# EAGLE design LCMeter_test_power_inverter (EAGLE 6.1)
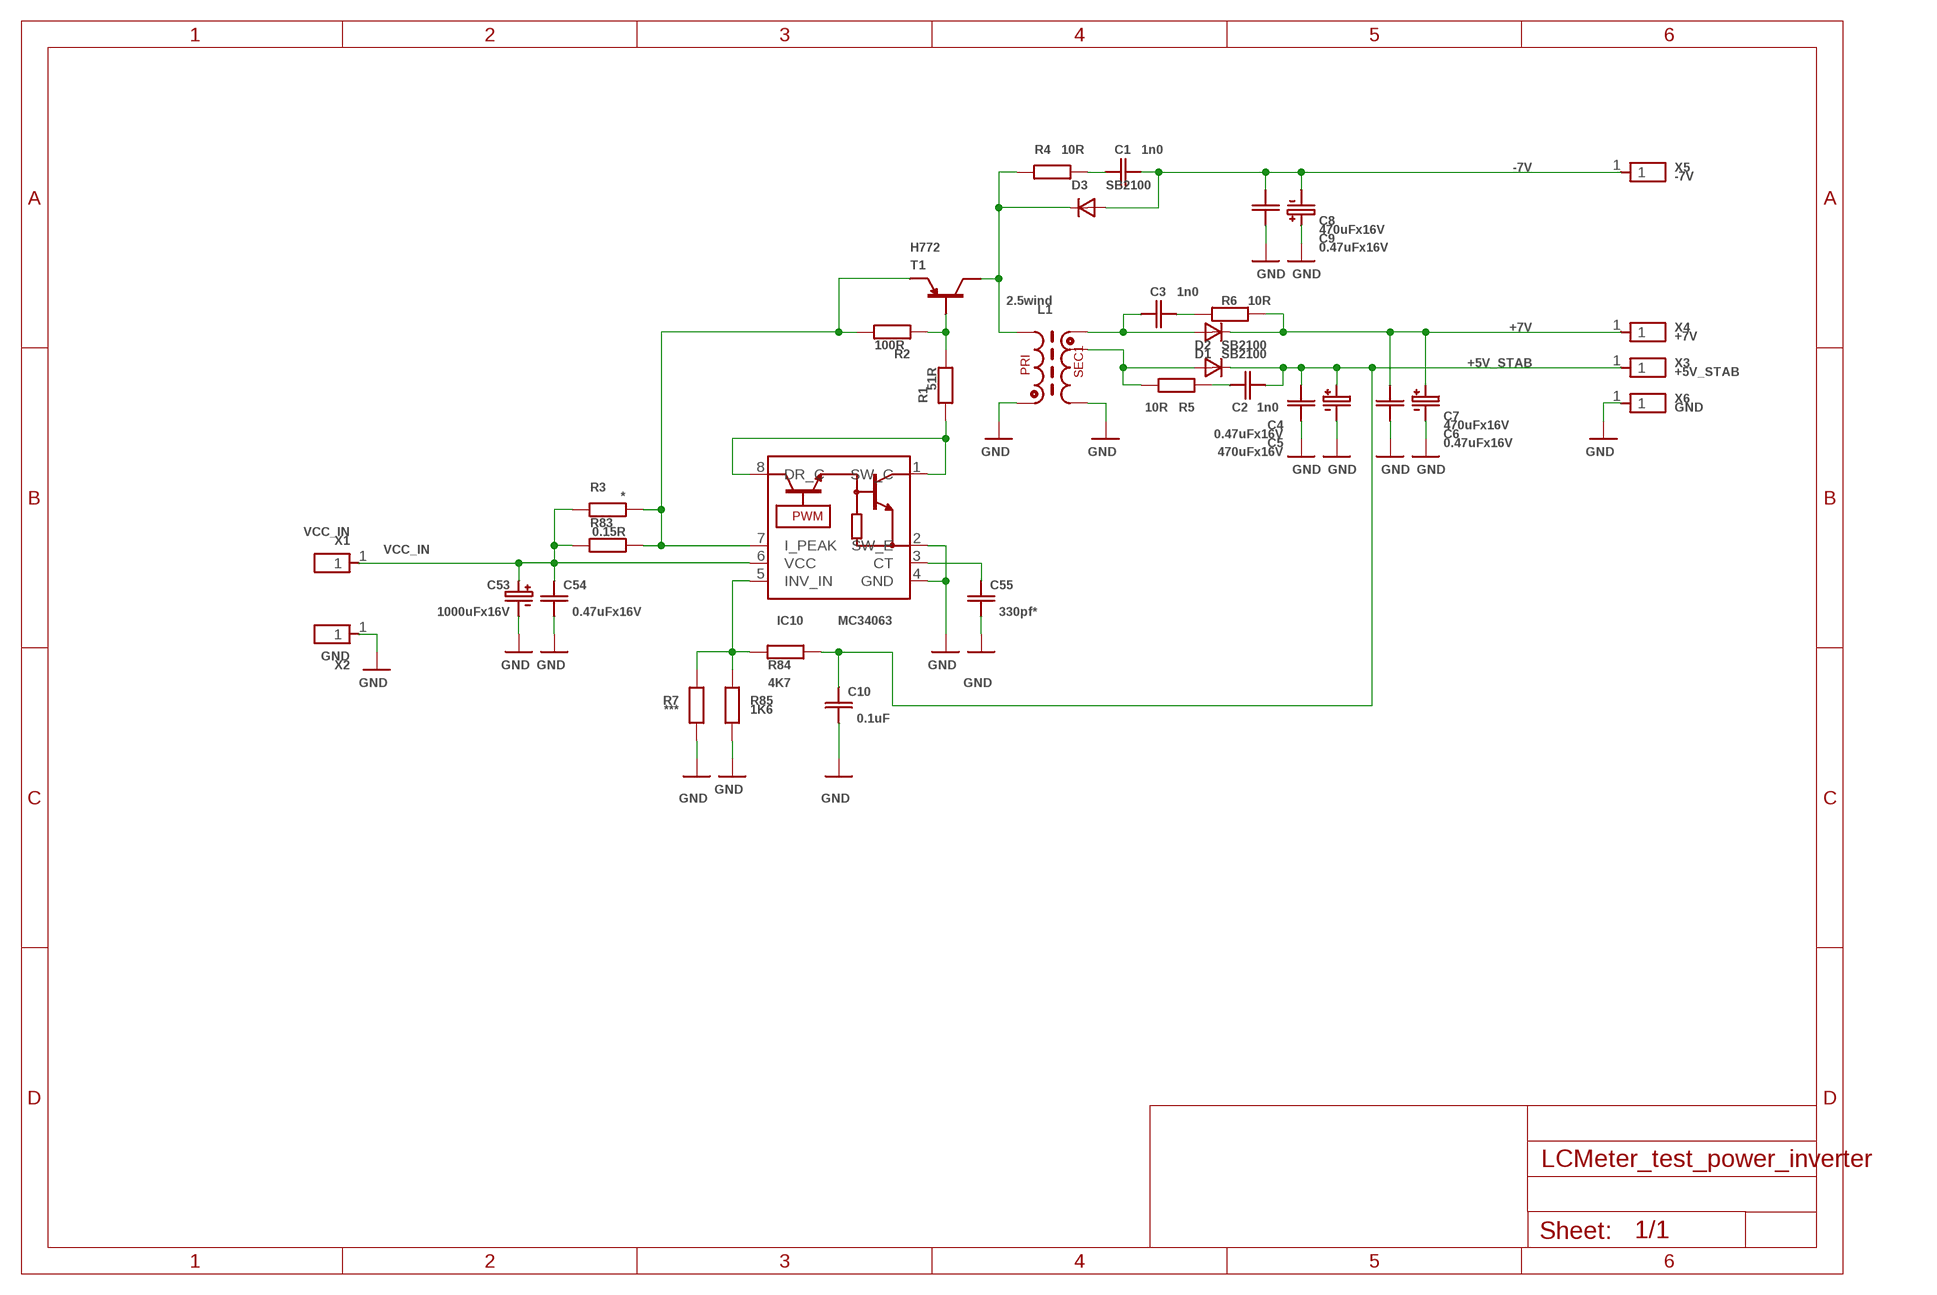
[diagram p0: schematic, sheet 1]

## Parts
C1  1n0  CSMD_0805  [RSMD_0805]
C2  1n0  CSMD_0805  [RSMD_0805]
C3  1n0  CSMD_0805  [RSMD_0805]
C4  0.47uFx16V  CSMD_1206_BIG_GAP  [RSMD_1206_BIG_GAP]
C5  470uFx16V  CE10MM  [CE_10MM]
C6  0.47uFx16V  CSMD_1206_BIG_GAP  [RSMD_1206_BIG_GAP]
C7  470uFx16V  CE10MM  [CE_10MM]
C8  470uFx16V  CE10MM  [CE_10MM]
C9  0.47uFx16V  CSMD_1206_BIG_GAP  [RSMD_1206_BIG_GAP]
C10  0.1uF  CSMD_0805  [RSMD_0805]
C53  1000uFx16V  CE10MM  [CE_10MM]
C54  0.47uFx16V  CSMD_1206  [RSMD_1206]
C55  330pf*  CSMD_0805  [RSMD_0805]
D1  SB2100  1N4001DO-41_12.5MM  [DO-41_12.5MM]
D2  SB2100  1N4001DO-41_5MM  [DO-41_5MM]
D3  SB2100  1N4001DO-41_12.5MM  [DO-41_12.5MM]
IC10  MC34063  MC34063(SO-8)  [SOIC8]
L1  2.5wind  TRANS_2.5_WIND16X8  [RING_16X8_2.5WIND]
R1  51R  RSMD_1206_BIG_GAP  [RSMD_1206_BIG_GAP]
R2  100R  RSMD_0805  [RSMD_0805]
R3  *  RSMD_1206_BIG_GAP  [RSMD_1206_BIG_GAP]
R4  10R  RSMD_1206_BIG_GAP  [RSMD_1206_BIG_GAP]
R5  10R  RSMD_1206_BIG_GAP  [RSMD_1206_BIG_GAP]
R6  10R  RSMD_1206_BIG_GAP  [RSMD_1206_BIG_GAP]
R7  ***  RSMD_0805  [RSMD_0805]
R83  0.15R  RSMD_1206_BIG_GAP  [RSMD_1206_BIG_GAP]
R84  4K7  R0207  [R0207]
R85  1K6  RSMD_0805  [RSMD_0805]
T1  H772  H772_PNPDPAK  [DPAK]
X1  VCC_IN  PIN1X13.5MM_PWR  [PIN1X1_3.5MM_PWR]
X2  GND  PIN1X13.5MM_PWR  [PIN1X1_3.5MM_PWR]
X3  +5V_STAB  PIN1X13.5MM_PWR  [PIN1X1_3.5MM_PWR]
X4  +7V  PIN1X13.5MM_PWR  [PIN1X1_3.5MM_PWR]
X5  -7V  PIN1X13.5MM_PWR  [PIN1X1_3.5MM_PWR]
X6  GND  PIN1X13.5MM_PWR  [PIN1X1_3.5MM_PWR]

## Nets
+5V_STAB: C2.PAD_0(PIN0) C4.PAD_1(PIN1) C5.PLUS C10.PAD_1(PIN1) D1.CATHODE R84.PAD1(PIN1) X3.1
+7V: C6.PAD_1(PIN1) C7.PLUS D2.CATHODE R6.PAD_0(PIN0) X4.1
-7V: C1.PAD_0(PIN0) C8.MINUS C9.PAD_1(PIN1) D3.ANODE X5.1
GND: C4.PAD_0(PIN0) C5.MINUS C6.PAD_0(PIN0) C7.MINUS C8.PLUS C9.PAD_0(PIN0) C10.PAD_0(PIN0) C53.MINUS C54.PAD_0(PIN0) C55.PAD_0(PIN0) IC10.2(SW_E) IC10.4(GND) L1.W1_START(PRI_START) L1.W2_END(SEC1_END) R7.PAD_0(PIN0) R85.PAD_0(PIN0) X2.1 X6.1
N$1: C3.PAD_0(PIN0) R6.PAD_1(PIN1)
N$2: R1.PAD_1(PIN1) R2.PAD_0(PIN0) T1.1(B)
N$3: IC10.7(I_PEAK) R2.PAD_1(PIN1) R3.PAD_1(PIN1) R83.PAD_1(PIN1) T1.3(E)
N$4: D3.CATHODE L1.W1_END(PRI_END) R4.PAD_1(PIN1) T1.2(C)
N$5: C1.PAD_1(PIN1) R4.PAD_0(PIN0)
N$7: D1.ANODE L1.W2_NEAR_START(SEC1_NEAR_START) R5.PAD_0(PIN0)
N$8: C3.PAD_1(PIN1) D2.ANODE L1.W2_START(SEC1_START)
N$10: C2.PAD_1(PIN1) R5.PAD_1(PIN1)
N$133: IC10.1(SW_C) IC10.8(DR_C) R1.PAD_0(PIN0)
N$135: C55.PAD_1(PIN1) IC10.3(CT)
N$139: IC10.5(INV_IN) R7.PAD_1(PIN1) R84.PAD_0(PIN0) R85.PAD_1(PIN1)
VCC_IN: C53.PLUS C54.PAD_1(PIN1) IC10.6(VCC) R3.PAD_0(PIN0) R83.PAD_0(PIN0) X1.1

## Library data of the parts
C1-C4 C6 C9 C10 C54 C55 = __MyCommonLib1:C
C5 C7 C8 C53 = __MyCommonLib1:CE
D1-D3 = __MyCommonLib1:1N4001
IC10 = __MyCommonLib1:MC34063
L1 = __MyCommonLib1:TRANS_2.5_WIND
R1-R7 R83-R85 = __MyCommonLib1:R
T1 = __MyCommonLib1:H772_PNP
X1-X6 = __MyCommonLib1:PIN1X1

## Board
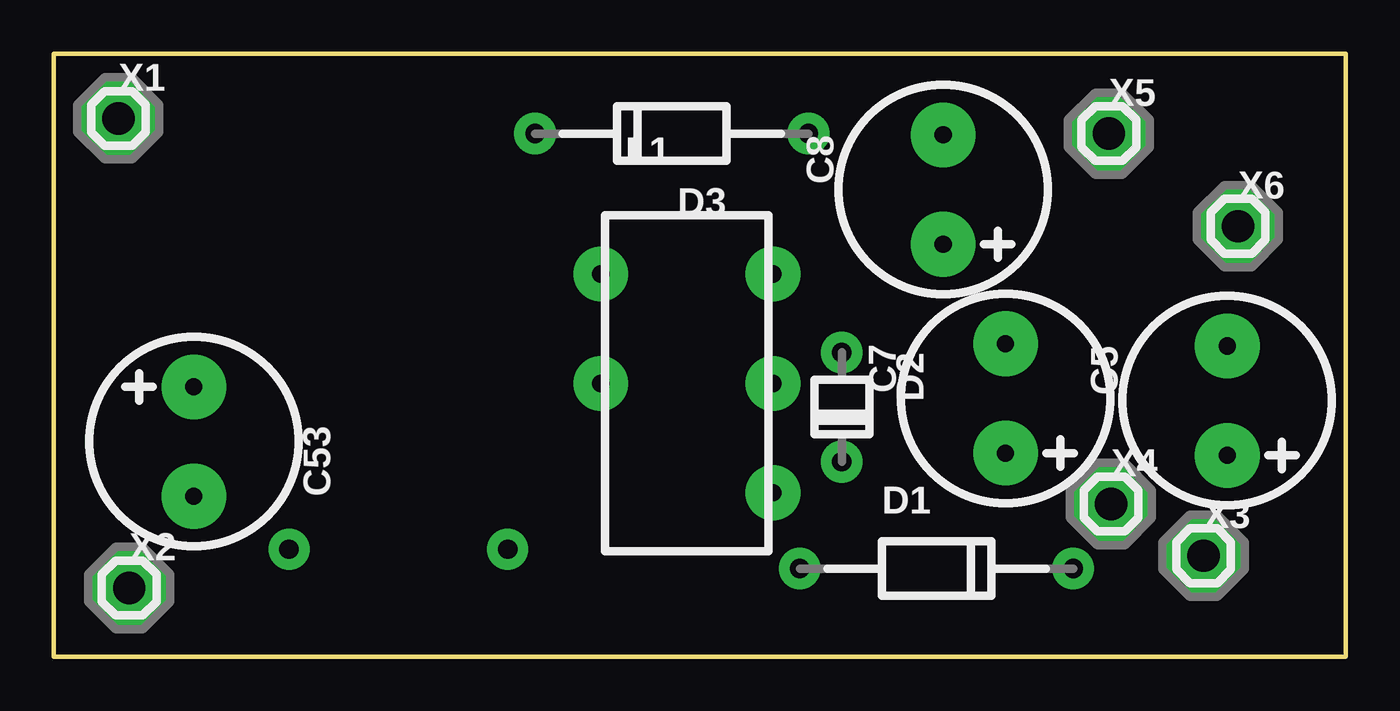
[diagram p1: board, top side]
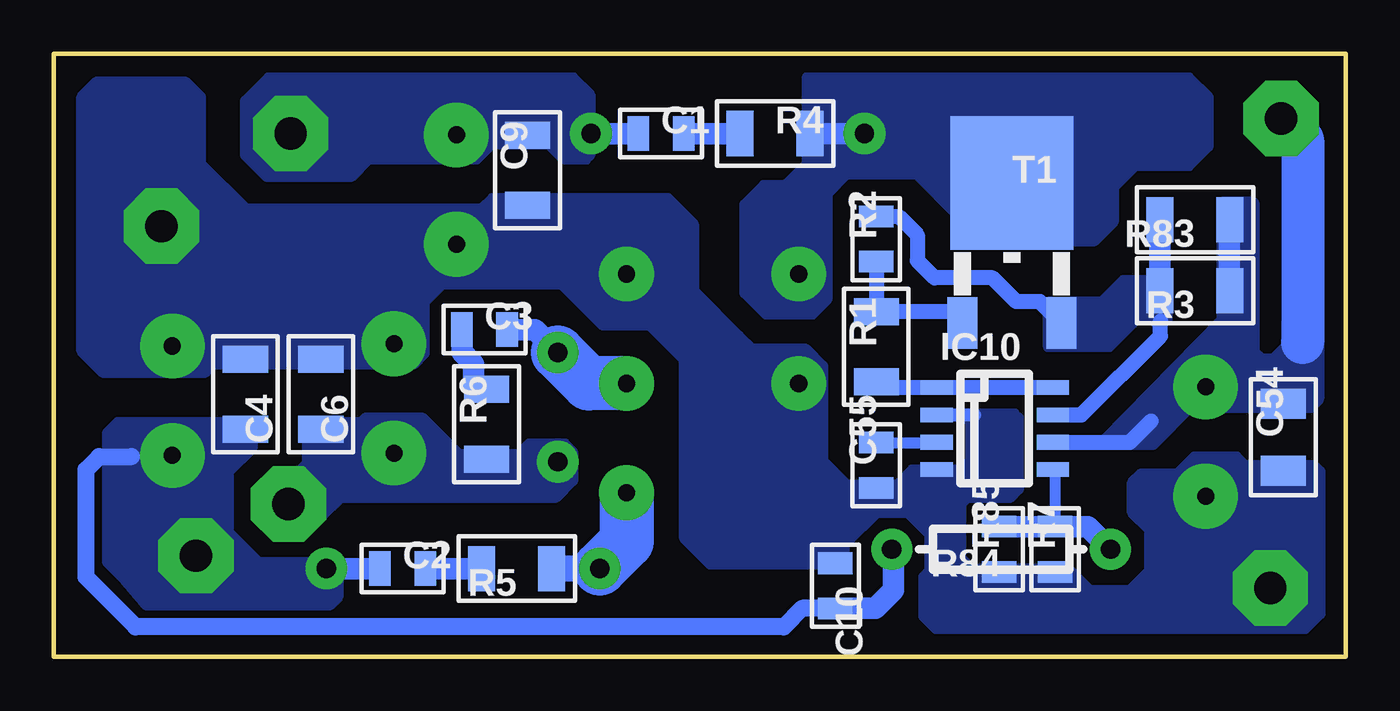
[diagram p2: board, bottom side, seen from below]

Size 60 x 28 mm. Coordinates in mm from the lower left corner, seen from the top.
Outline: 0,0 0,28 60,28 60,0 0,0
Copper layers (1*16): Top 0.035mm / dielectric 1.5mm / Bottom 0.035mm
Design rules: minimum track width 0.35mm, minimum drill 0.6mm, track to track 0.35mm, track to pad 0.35mm, pad to pad 0.35mm, via to via 0.35mm, smd to smd 0.1mm, copper to edge 0.2mm, drill to drill 8mil, minimum pad ring 10mil, minimum via ring 8mil, stop-mask expansion 4mil, vias tented up to drill 0mil, thermal gap 10mil

### Footprints (pad centres in the part's own frame; a part is rotated, then mirrored left to right if it is on the bottom)
RSMD_0805 = smd 1 x 1.6: PAD_0 -1.05,0; PAD_1 1.05,0
RSMD_1206_BIG_GAP = smd 1.25 x 2.1: PAD_0 -1.625,0; PAD_1 1.625,0
CE_10MM = drill 0.8 pad 3: MINUS -2.54,0; PLUS 2.54,0
RSMD_1206 = smd 1.4 x 2.1: PAD_0 -1.55,0; PAD_1 1.55,0
DO-41_12.5MM = drill 0.9 pad 1.93: ANODE -6.35,0; CATHODE 6.35,0
DO-41_5MM = drill 0.9 pad 1.93: ANODE -2.54,0; CATHODE 2.54,0
SOIC8 = smd 1.5 x 0.68: 1 -2.699,1.905; 2 -2.699,0.635; 3 -2.699,-0.635; 4 -2.699,-1.905; 5 2.699,-1.905; 6 2.699,-0.635; 7 2.699,0.635; 8 2.699,1.905
RING_16X8_2.5WIND = drill 0.8 pad 2.54: W1_END -4,5.08; W1_START 4,5.08; W2_END -4,0; W2_NEAR_START 4,-5.08; W2_START 4,0
R0207 = drill 0.9 pad 1.9: PAD1 5.08,0; PAD_0 -5.08,0
DPAK = smd 1.4 x 2.4: 1 -2.3,-6.5; 3 2.3,-6.5 | smd 5.7 x 6.2: 2 0,0
PIN1X1_3.5MM_PWR = drill 1.5 pad 3.5 octagon: 1 0,0

### Placement (x,y rotation side)
C1  31.8,24.3 0 bottom
C2  43.8,4.1 0 bottom
C3  40,15.2 0 bottom
C4  51.1,12.2 270 bottom
C5  54.5,11.9 270 top
C6  47.6,12.2 270 bottom
C7  44.2,12 270 top
C8  41.3,21.7 270 top
C9  38,22.6 90 bottom
C10  23.7,3.3 270 bottom
C53  6.5,10 90 top
C54  2.9,10.2 90 bottom
C55  21.8,8.9 90 bottom
D1  41,4.1 0 top
D2  36.6,11.6 270 top
D3  28.7,24.3 180 top
IC10  16.3,10.6 0 bottom
L1  29.4,12.7 0 top
R1  21.8,14.4 90 bottom
R2  21.8,19.4 90 bottom
R3  7,17 180 bottom
R4  26.5,24.3 0 bottom
R5  38.5,4.1 180 bottom
R6  39.9,10.8 90 bottom
R7  13.5,5 90 bottom
R83  7,20.3 180 bottom
R84  16,5 180 bottom
R85  16.1,5 90 bottom
T1  15.5,22 0 bottom
X1  3,25 0 top
X2  3.5,3.2 0 top
X3  53.4,4.7 0 top
X4  49.1,7.1 0 top
X5  49,24.3 0 top
X6  55,20 0 top

### Tracks (layer width: path | path; a pad name or v marks a point on that pad's centre or on a via)
+5V_STAB
  Bottom 0.8: C10.PAD_1 25.25,2.25 26.1,1.4 56.2,1.4 58.5,3.7 58.5,8.7 57.9,9.3 56.4,9.3
  Bottom 1: C2.PAD_0 D1.CATHODE | C10.PAD_1 21.85,2.25 21,3.1 21,4.92 R84.PAD1
  pour Bottom (no thermals): 46.8,2.8 47.2,2.4 55.7,2.4 56.9,3.8 57.5,4.4 57.5,10.4 57,10.9 50.8,10.9 50.8,9.7 51.9,8.6 51.9,5.8 50.5,4.4 46.8,4.4
+7V
  pour Bottom (no thermals): 35.9,9.4 35.9,8.2 36.7,7.4 46.7,7.4 47.6,6.5 49.9,6.5 49.9,7.8 49.1,8.6 48.6,8.6 48.2,9 48.2,10.8 48.1,10.9 45.7,10.9 45.5,11.1 42.9,11.1 41.9,10.1 41.2,9.4 39.7,9.4 38.4,9.4 37.9,9.9 36.3,9.9 35.9,9.5
-7V
  Bottom 1: C1.PAD_0 D3.ANODE
  pour Bottom (no thermals): 35.9,26.9 35.1,26.1 35.1,23.3 35.3,23.1 36.3,23.1 37,23.8 39.7,23.8 40.4,23.1 45.4,23.1 46.2,22.3 50.1,22.3 51.1,23.3 51.1,25.8 50,26.9
GND
  Bottom 0.6: IC10.2 17.23,11.23
  pour Bottom (no thermals): 51.1,13.6 52.6,13.6 53,13.2 57.7,13.2 58.7,14.2 58.7,26 58,26.7 53.9,26.7 53.2,26 53.2,22.9 51.1,20.8 40.1,20.8 39.6,21.3 31.5,21.3 31,20.8 30.3,20.1 30.3,19.1 30.3,17 28.2,14.9 27.6,14.3 25.1,14.3 24.3,13.5 24.3,11.6 24.3,9.1 23.3,8.1 23.3,4.4 23.4,4.3 29.5,4.3 30.7,5.5 30.7,13.8 32.1,15.2 32.3,15.4 34.5,15.4 36.4,17.3 40.6,17.3 42,17.3 42.8,16.5 42.8,14.1 43.3,13.6
  pour Bottom (no thermals): 4.7,8.9 1.5,8.9 1.2,8.6 1.2,2 1.9,1.3 19,1.3 19.6,1.9 19.6,3.7 19.3,4 19.3,5.7 20.3,6.7 21.8,6.7 23.2,5.3 23.9,5.3 23.9,8 20.8,8 20.1,8.7 17.8,8.7 17.4,9.1 17.4,10.9 17.7,11.2 17.6,11.3 15.4,11.3 15.2,11.1 15.2,7.8 15.6,7.4 17.6,7.4 17.9,7.1 17.9,4.6 17.4,4.1 12.9,4.1 11.9,3.1 10,3.1 9.1,4 9.1,5.9 9.9,6.7 9.9,8.1 9.5,8.5 7.8,8.5 7,9.3 5.1,9.3
N$1
  Bottom 1: C3.PAD_0 41.05,14.15 40.5,13.6 40.5,12.4 39.92,12.4 R6.PAD_1
N$2
  Bottom 0.7: T1.1 18.32,16.02 R1.PAD_1 R2.PAD_0
N$3
  Bottom 0.7: IC10.7 12.27,11.23 8.6,14.9 8.6,15.6 | T1.3 14.2,16.5 15.3,16.5 16.4,17.6 19.1,17.6 19.9,18.4 19.9,19.6 20.75,20.45 R2.PAD_1
  Bottom 1: R83.PAD_1 R3.PAD_1
  pour Bottom (no thermals): 8.3,17.5 8.3,15.7 8.6,15.4 8.7,15.4 9.1,15.8 9.6,15.8 11,14.4 13.8,14.4 13.8,16.4 13.7,16.5 11.3,16.5 10.3,17.5
N$4
  Bottom 1: D3.CATHODE R4.PAD_1
  pour Bottom (no thermals): 7.3,26.9 6.4,26 6.4,23.7 7.3,22.8 9.8,22.8 10.8,21.8 10.8,20.2 11.7,19.3 18,19.3 18,20.5 19.9,22.4 23.2,22.4 24.1,21.5 24.1,16.6 24.8,15.9 26.9,15.9 27.9,16.9 27.9,21 27,21.9 26,21.9 25,22.9 25,26.9
N$5
  Bottom 1: R4.PAD_0 C1.PAD_1
N$7
  Bottom 1.2: D1.ANODE R5.PAD_0
  Bottom 2.5: L1.W2_NEAR_START 33.4,5.35 D1.ANODE
N$8
  Bottom 1: C3.PAD_1 37.66,15.2 D2.ANODE
  Bottom 2.5: L1.W2_START 35.16,12.7 D2.ANODE
N$10
  Bottom 1: R5.PAD_1 C2.PAD_1
N$133
  Bottom 0.7: IC10.8 IC10.1 21.53,12.51 R1.PAD_0
N$135
  Bottom 0.5: C55.PAD_1 IC10.3
N$139
  Bottom 0.5: IC10.5 13.5,8.7 R7.PAD_1
  Bottom 1: R84.PAD_0 11.97,6.05 R7.PAD_1 R85.PAD_1
VCC_IN
  Bottom 0.7: IC10.6 10.04,9.96 9.04,10.96
  Bottom 1: R83.PAD_0 5.4,20.27 5.4,17.4 5.38,17.38 R3.PAD_0
  Bottom 2: X1.1 2,24 2,14.6
  pour Bottom (no thermals): 1.4,15.5 1.4,12 1.7,11.7 7.3,11.7 9,10 11.1,10 5.6,15.6 5.6,21 4.4,21 4.4,14.1 4,13.7 3.3,13.7 2.6,14.4 2.6,15.5